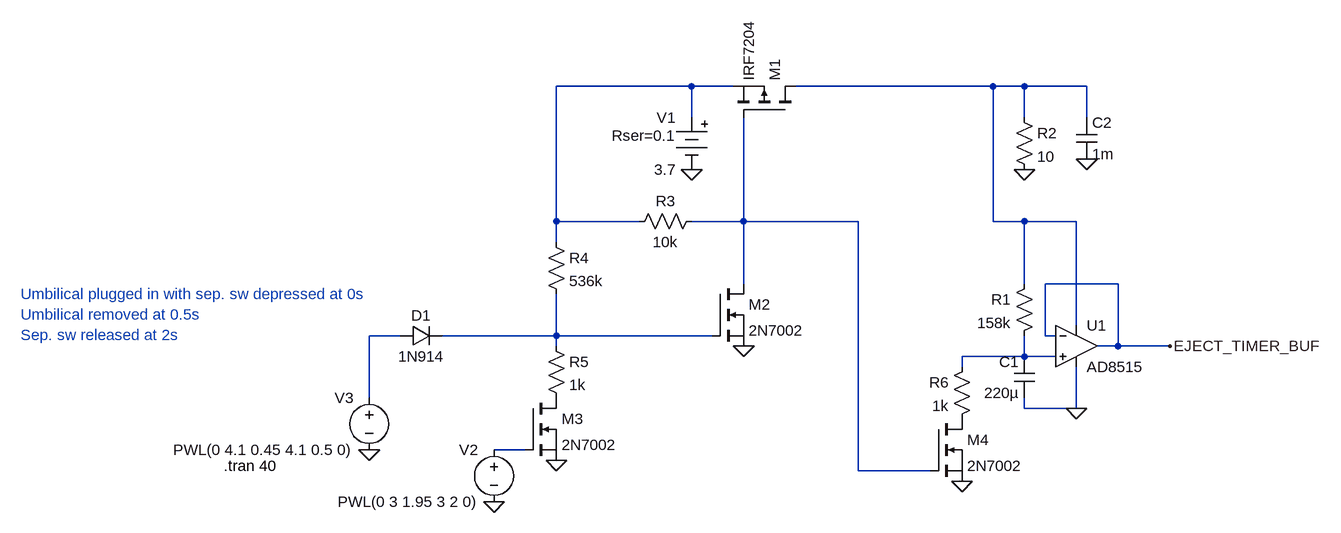
[diagram p0: schematic EjectTimer.asc]
EjectTimer.asc, the LTspice schematic file:
Version 4
SHEET 1 880 680
WIRE -128 -256 -336 -256
WIRE -64 -256 -128 -256
WIRE 336 -256 32 -256
WIRE 384 -256 336 -256
WIRE 480 -256 384 -256
WIRE -128 -208 -128 -256
WIRE 384 -208 384 -256
WIRE 480 -208 480 -256
WIRE -336 -48 -336 -256
WIRE -208 -48 -336 -48
WIRE -48 -48 -48 -208
WIRE -48 -48 -128 -48
WIRE 128 -48 -48 -48
WIRE 336 -48 336 -256
WIRE 384 -48 336 -48
WIRE 464 -48 384 -48
WIRE -336 -16 -336 -48
WIRE -48 48 -48 -48
WIRE 384 48 384 -48
WIRE 528 48 416 48
WIRE 464 112 464 -48
WIRE -576 128 -624 128
WIRE -336 128 -336 64
WIRE -336 128 -512 128
WIRE -96 128 -336 128
WIRE 416 128 416 48
WIRE 432 128 416 128
WIRE -336 144 -336 128
WIRE 528 144 528 48
WIRE 528 144 496 144
WIRE 608 144 528 144
WIRE 384 160 384 128
WIRE 384 160 288 160
WIRE 432 160 384 160
WIRE 288 176 288 160
WIRE -624 224 -624 128
WIRE 384 240 384 224
WIRE 464 240 464 176
WIRE 464 240 384 240
WIRE -384 304 -432 304
WIRE 128 336 128 -48
WIRE 240 336 128 336
FLAG 464 240 0
FLAG 608 144 EJECT_TIMER_BUF
FLAG -128 -128 0
FLAG 384 -128 0
FLAG -48 144 0
FLAG -624 304 0
FLAG -336 320 0
FLAG -432 384 0
FLAG 288 352 0
FLAG 480 -144 0
SYMBOL Opamps\\AD8515 464 80 R0
SYMATTR InstName U1
SYMBOL cap 400 160 M0
SYMATTR InstName C1
SYMATTR Value 220µ
SYMBOL res 400 32 M0
SYMATTR InstName R1
SYMATTR Value 158k
SYMBOL Misc\\battery -128 -224 M0
WINDOW 123 0 0 Left 0
WINDOW 39 24 44 Left 2
SYMATTR SpiceLine Rser=0.1
SYMATTR InstName V1
SYMATTR Value 3.7
SYMBOL pmos 32 -208 M270
SYMATTR InstName M1
SYMATTR Value IRF7204
SYMBOL res 368 -224 R0
SYMATTR InstName R2
SYMATTR Value 10
SYMBOL res -224 -32 R270
WINDOW 0 32 56 VTop 2
WINDOW 3 0 56 VBottom 2
SYMATTR InstName R3
SYMATTR Value 10k
SYMBOL nmos -96 48 R0
SYMATTR InstName M2
SYMATTR Value 2N7002
SYMBOL res -352 -32 R0
SYMATTR InstName R4
SYMATTR Value 536k
SYMBOL res -352 128 R0
SYMATTR InstName R5
SYMATTR Value 1k
SYMBOL voltage -432 288 M0
WINDOW 123 0 0 Left 0
WINDOW 39 0 0 Left 0
SYMATTR InstName V2
SYMATTR Value PWL(0 3 1.95 3 2 0)
SYMBOL voltage -624 208 M0
WINDOW 123 0 0 Left 0
WINDOW 39 0 0 Left 0
SYMATTR InstName V3
SYMATTR Value PWL(0 4.1 0.45 4.1 0.5 0)
SYMBOL nmos -384 224 R0
SYMATTR InstName M3
SYMATTR Value 2N7002
SYMBOL res 304 160 M0
SYMATTR InstName R6
SYMATTR Value 1k
SYMBOL nmos 240 256 R0
SYMATTR InstName M4
SYMATTR Value 2N7002
SYMBOL diode -576 144 R270
WINDOW 0 32 32 VTop 2
WINDOW 3 0 32 VBottom 2
SYMATTR InstName D1
SYMATTR Value 1N914
SYMBOL cap 464 -208 R0
SYMATTR InstName C2
SYMATTR Value 1m
TEXT -848 328 Left 2 !.tran 40
TEXT -1160 64 Left 2 ;Umbilical plugged in with sep. sw depressed at 0s\nUmbilical removed at 0.5s\nSep. sw released at 2s

The netlist it stands for:
* EjectTimer.asc
XU1 N006 EJECT_TIMER_BUF N002 0 EJECT_TIMER_BUF AD8515  ; pins In+ In- V+ V- OUT
C1 N006 0 220µ
R1 N002 N006 158k
V1 N001 0 3.7 Rser=0.1
M1 N002 N003 N001 N001 IRF7204
R2 N002 0 10
R3 N001 N003 10k
M2 N003 N005 0 0 2N7002
R4 N001 N005 536k
R5 N005 P001 1k
V2 N007 0 PWL(0 3 1.95 3 2 0)
V3 N004 0 PWL(0 4.1 0.45 4.1 0.5 0)
M3 P001 N007 0 0 2N7002
R6 N006 P002 1k
M4 P002 N003 0 0 2N7002
D1 N004 N005 1N914
C2 N002 0 1m
.model D D
.lib standard.dio
.model NMOS NMOS
.model PMOS PMOS
.lib standard.mos
.tran 40
* Umbilical plugged in with sep. sw depressed at 0s
* Umbilical removed at 0.5s
* Sep. sw released at 2s
.lib ADI.lib
.backanno
.end